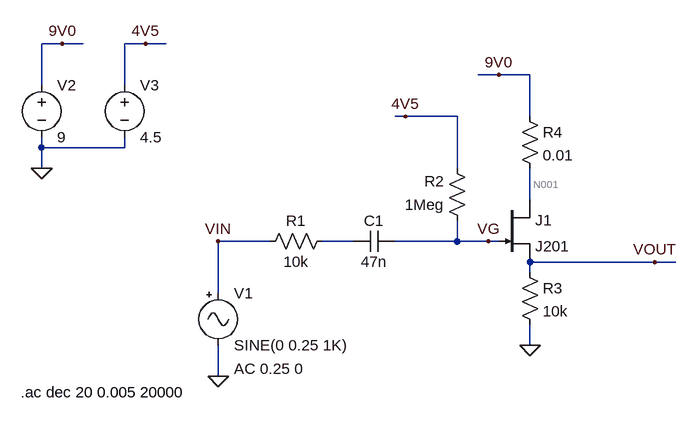
[diagram p0: schematic mt2_input.asc]
mt2_input.asc, the LTspice schematic file:
Version 4
SHEET 1 880 680
WIRE -272 -224 -304 -224
WIRE -240 -224 -272 -224
WIRE -144 -224 -176 -224
WIRE -112 -224 -144 -224
WIRE 400 -176 368 -176
WIRE 448 -176 400 -176
WIRE -304 -160 -304 -224
WIRE -176 -160 -176 -224
WIRE 256 -112 240 -112
WIRE 336 -112 256 -112
WIRE 448 -112 448 -176
WIRE -304 -64 -304 -80
WIRE -176 -64 -176 -80
WIRE -176 -64 -304 -64
WIRE -304 -32 -304 -64
WIRE 336 -32 336 -112
WIRE 448 16 448 -32
WIRE 48 80 -32 80
WIRE 176 80 128 80
WIRE 336 80 336 48
WIRE 336 80 240 80
WIRE 384 80 336 80
WIRE 400 80 384 80
WIRE 640 112 448 112
WIRE 672 112 640 112
WIRE 448 128 448 112
WIRE -32 160 -32 80
WIRE 448 240 448 208
WIRE -32 288 -32 240
FLAG -304 -32 0
FLAG -32 288 0
FLAG -272 -224 9V0
FLAG -144 -224 4V5
FLAG 256 -112 4V5
FLAG 448 240 0
FLAG 400 -176 9V0
FLAG 640 112 VOUT
FLAG 384 80 VG
FLAG -32 80 VIN
SYMBOL Misc\\signal -32 144 R0
WINDOW 123 24 132 Left 2
WINDOW 39 0 0 Left 0
SYMATTR Value2 AC 0.25 0
SYMATTR InstName V1
SYMATTR Value SINE(0 0.25 1K)
SYMBOL voltage -304 -176 R0
WINDOW 123 0 0 Left 0
WINDOW 39 0 0 Left 0
SYMATTR InstName V2
SYMATTR Value 9
SYMBOL voltage -176 -176 R0
WINDOW 123 0 0 Left 0
WINDOW 39 0 0 Left 0
SYMATTR InstName V3
SYMATTR Value 4.5
SYMBOL res 144 64 R90
WINDOW 0 0 56 VBottom 2
WINDOW 3 32 56 VTop 2
SYMATTR InstName R1
SYMATTR Value 10k
SYMBOL res 352 64 R180
WINDOW 0 36 76 Left 2
WINDOW 3 36 40 Left 2
SYMATTR InstName R2
SYMATTR Value 1Meg
SYMBOL cap 240 64 R90
WINDOW 0 0 32 VBottom 2
WINDOW 3 32 32 VTop 2
SYMATTR InstName C1
SYMATTR Value 47n
SYMBOL njf 400 16 R0
SYMATTR InstName J1
SYMATTR Value J201
SYMBOL res 432 112 R0
SYMATTR InstName R3
SYMATTR Value 10k
SYMBOL res 432 -128 R0
SYMATTR InstName R4
SYMATTR Value 0.01
TEXT -336 312 Left 2 !.ac dec 20 0.005 20000

The netlist it stands for:
* mt2_input.asc
V1 VIN 0 SINE(0 0.25 1K) AC 0.25 0
V2 9V0 0 9
V3 4V5 0 4.5
R1 N002 VIN 10k
R2 VG 4V5 1Meg
C1 VG N002 47n
J1 N001 VG VOUT J201
R3 VOUT 0 10k
R4 9V0 N001 0.01
.model NJF NJF
.model PJF PJF
.lib standard.jft
.ac dec 20 0.005 20000
.backanno
.end

* Results of the author's LTspice run, read from the files saved beside the schematic
* Operating Point, zero values left out:
*   V(9v0) = 9 V
*   V(4v5) = 4.5 V
*   V(vg) = 4.5 V
*   V(n001) = 9 V
*   V(vout) = 4.766 V
*   Id(J1) = 476.6 µA
*   Ig(J1) = -4.771 pA
*   Is(J1) = -476.6 µA
*   I(R4) = 476.6 µA
*   I(R3) = 476.6 µA
*   I(R2) = 4.771 pA
*   I(V3) = 4.771 pA
*   I(V2) = -476.6 µA
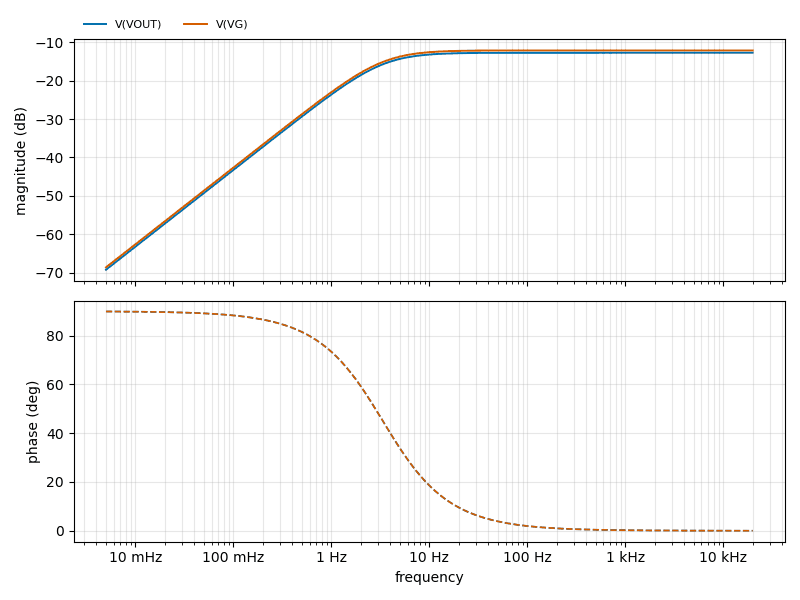
[diagram p1: AC Analysis of mt2_input.asc, plotted from the saved traces]
* AC Analysis, 1 run:
*   V(VOUT): -69.26 dB at 5 mHz, -12.73 dB at 20 kHz, peak -12.73 dB at 11.19 kHz, 3 dB below the peak at 3.358 Hz
*   V(VG): -68.66 dB at 5 mHz, -12.13 dB at 20 kHz, peak -12.13 dB at 11.19 kHz, 3 dB below the peak at 3.358 Hz